# EAGLE design untitled (EAGLE 9.6.2)

## Sheet 1 of 3
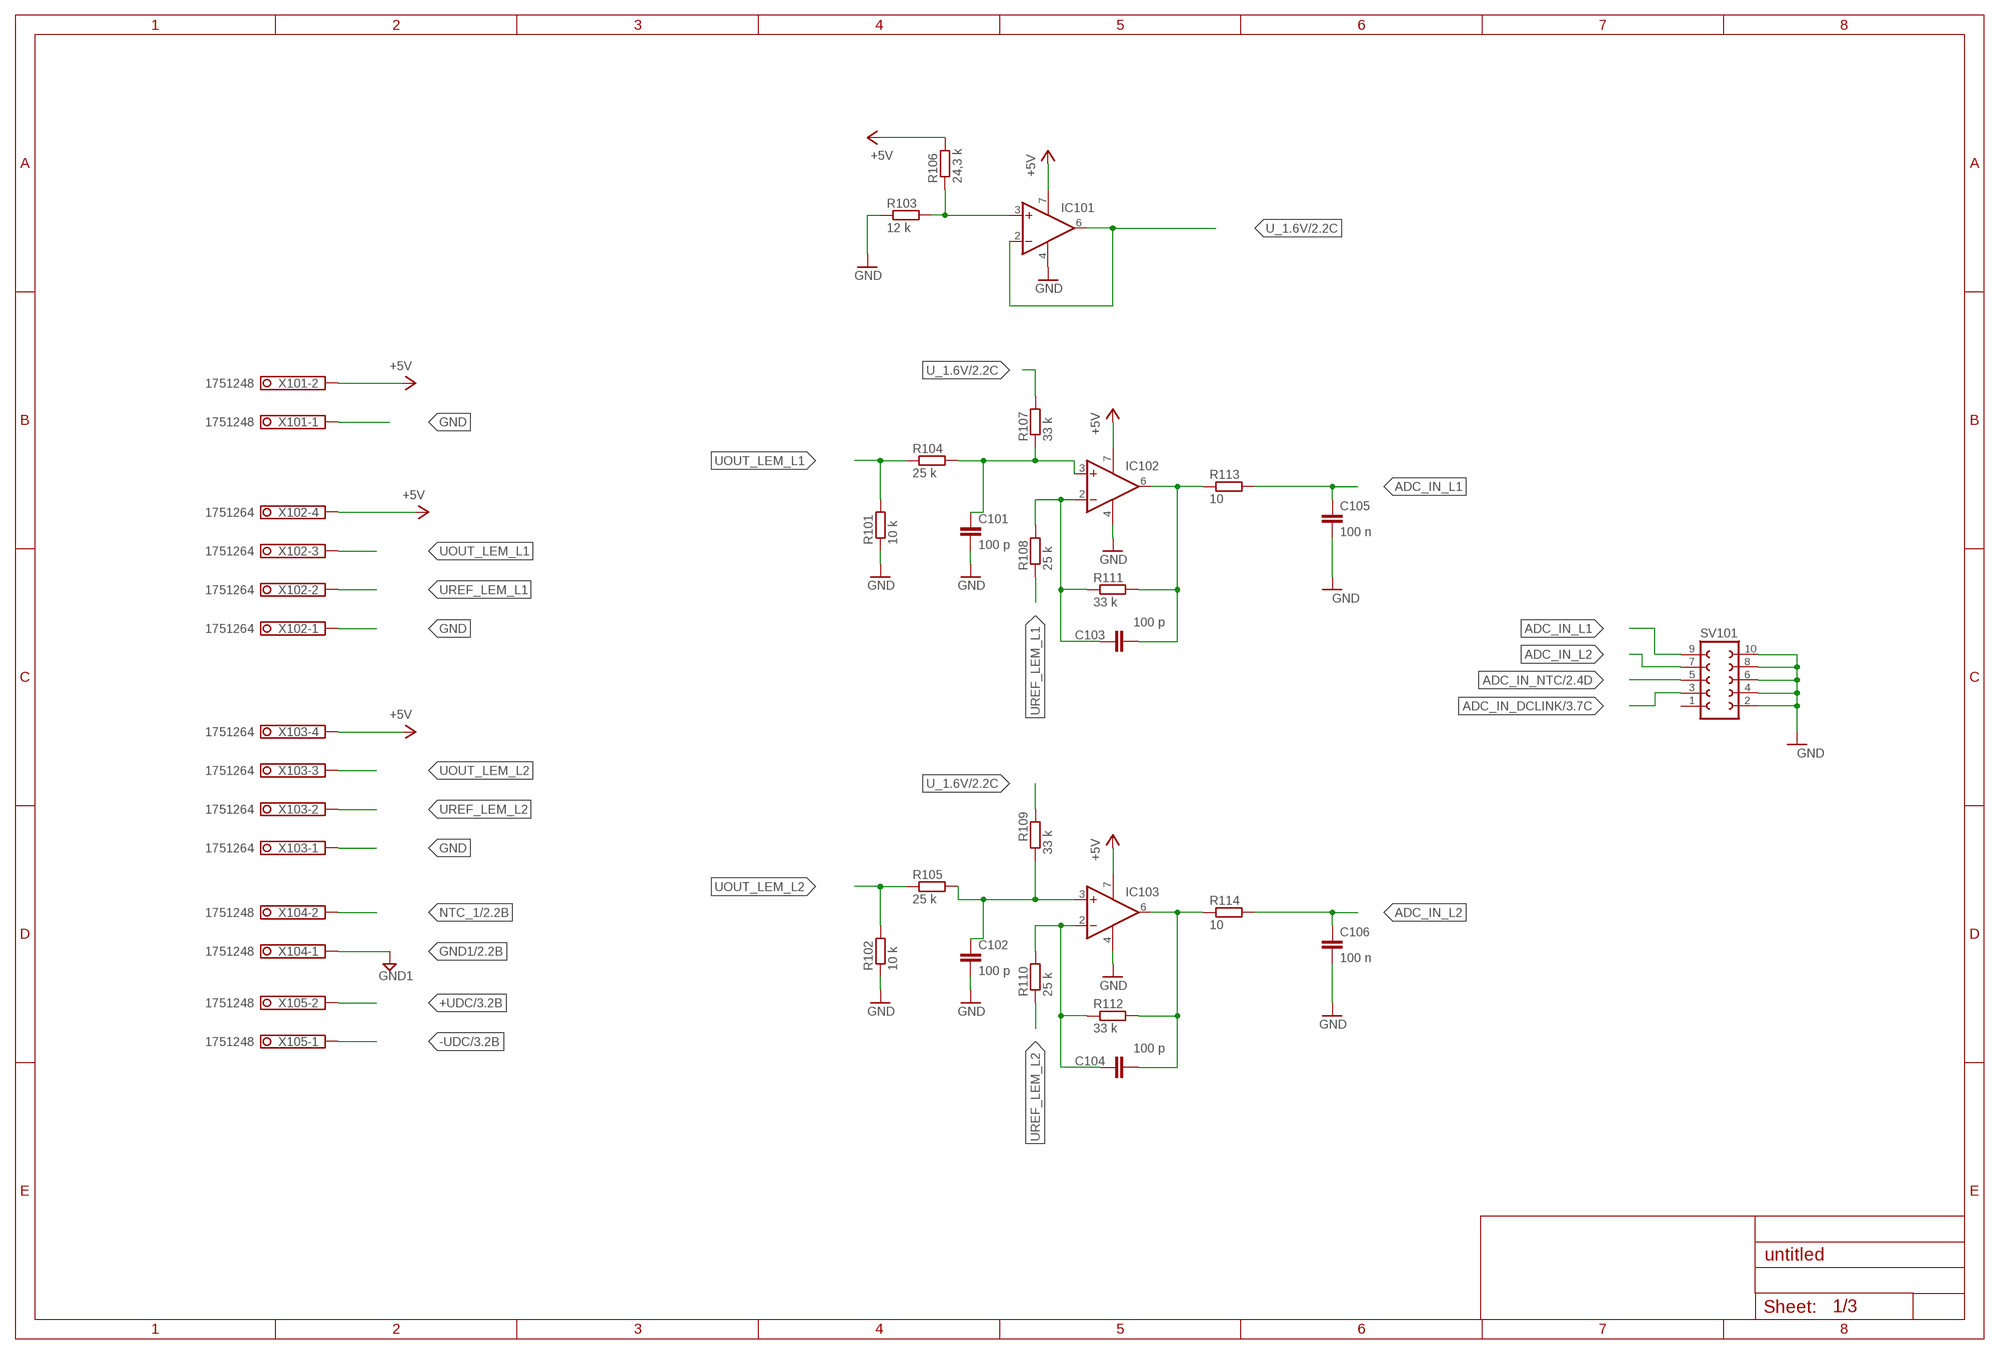
[diagram p0: schematic, sheet 1]

### Parts
C101  100 p  C-EUC0603  [C0603]
C102  100 p  C-EUC0603  [C0603]
C103  100 p  C-EUC0603  [C0603]
C104  100 p  C-EUC0603  [C0603]
C105  100 n  C-EUC1206  [C1206]
C106  100 n  C-EUC1206  [C1206]
IC101  1AMP_P7+4D  [SO08]
IC102  1AMP_P7+4D  [SO08]
IC103  1AMP_P7+4D  [SO08]
R101  10 k  R-EU_R0402  [R0402]
R102  10 k  R-EU_R0402  [R0402]
R103  12 k  R-EU_R0402  [R0402]
R104  25 k  R-EU_R0402  [R0402]
R105  25 k  R-EU_R0402  [R0402]
R106  24,3 k  R-EU_R0402  [R0402]
R107  33 k  R-EU_R0402  [R0402]
R108  25 k  R-EU_R0402  [R0402]
R109  33 k  R-EU_R0402  [R0402]
R110  25 k  R-EU_R0402  [R0402]
R111  33 k  R-EU_R0402  [R0402]
R112  33 k  R-EU_R0402  [R0402]
R113  10  R-EU_R0402  [R0402]
R114  10  R-EU_R0402  [R0402]
SV101  FE05-2  [FE05-2]
X101  1751248  [1751248]
X102  1751264  [1751264]
X103  1751264  [1751264]
X104  1751248  [1751248]
X105  1751248  [1751248]

### Nets
+5V: IC101.7(V+) IC102.7(V+) IC103.7(V+) R106.2 X101.2 X102.4 X103.4 ; also sheet 2,3
+UDC: X105.2 ; also sheet 3
-UDC: X105.1 ; also sheet 3
ADC_IN_DCLINK: SV101.3 ; also sheet 3
ADC_IN_L1: C105.1 R113.2 SV101.9
ADC_IN_L2: C106.1 R114.2 SV101.7
ADC_IN_NTC: SV101.5 ; also sheet 2
GND: C101.2 C102.2 C105.2 C106.2 IC101.4(V-) IC102.4(V-) IC103.4(V-) R101.1 R102.1 R103.1 SV101.2 SV101.4 SV101.6 SV101.8 SV101.10 X101.1 X102.1 X103.1 ; also sheet 2,3
GND1: X104.1 ; also sheet 2
N$1: C104.1 IC103.2(-IN) R110.2 R112.1
N$2: C104.2 IC103.6(OUT) R112.2 R114.1
N$3: C103.1 IC102.2(-IN) R108.2 R111.1
N$5: C103.2 IC102.6(OUT) R111.2 R113.1
N$8: IC101.3(+IN) R103.2 R106.1
N$15: C102.1 IC103.3(+IN) R105.2 R109.1
N$16: C101.1 IC102.3(+IN) R104.2 R107.1
NTC_1: X104.2 ; also sheet 2
U_1.6V: IC101.2(-IN) IC101.6(OUT) R107.2 R109.2 ; also sheet 2,3
UOUT_LEM_L1: R101.2 R104.1 X102.3
UOUT_LEM_L2: R102.2 R105.1 X103.3
UREF_LEM_L1: R108.1 X102.2
UREF_LEM_L2: R110.1 X103.2
Unconnected: SV101.1

## Sheet 2 of 3
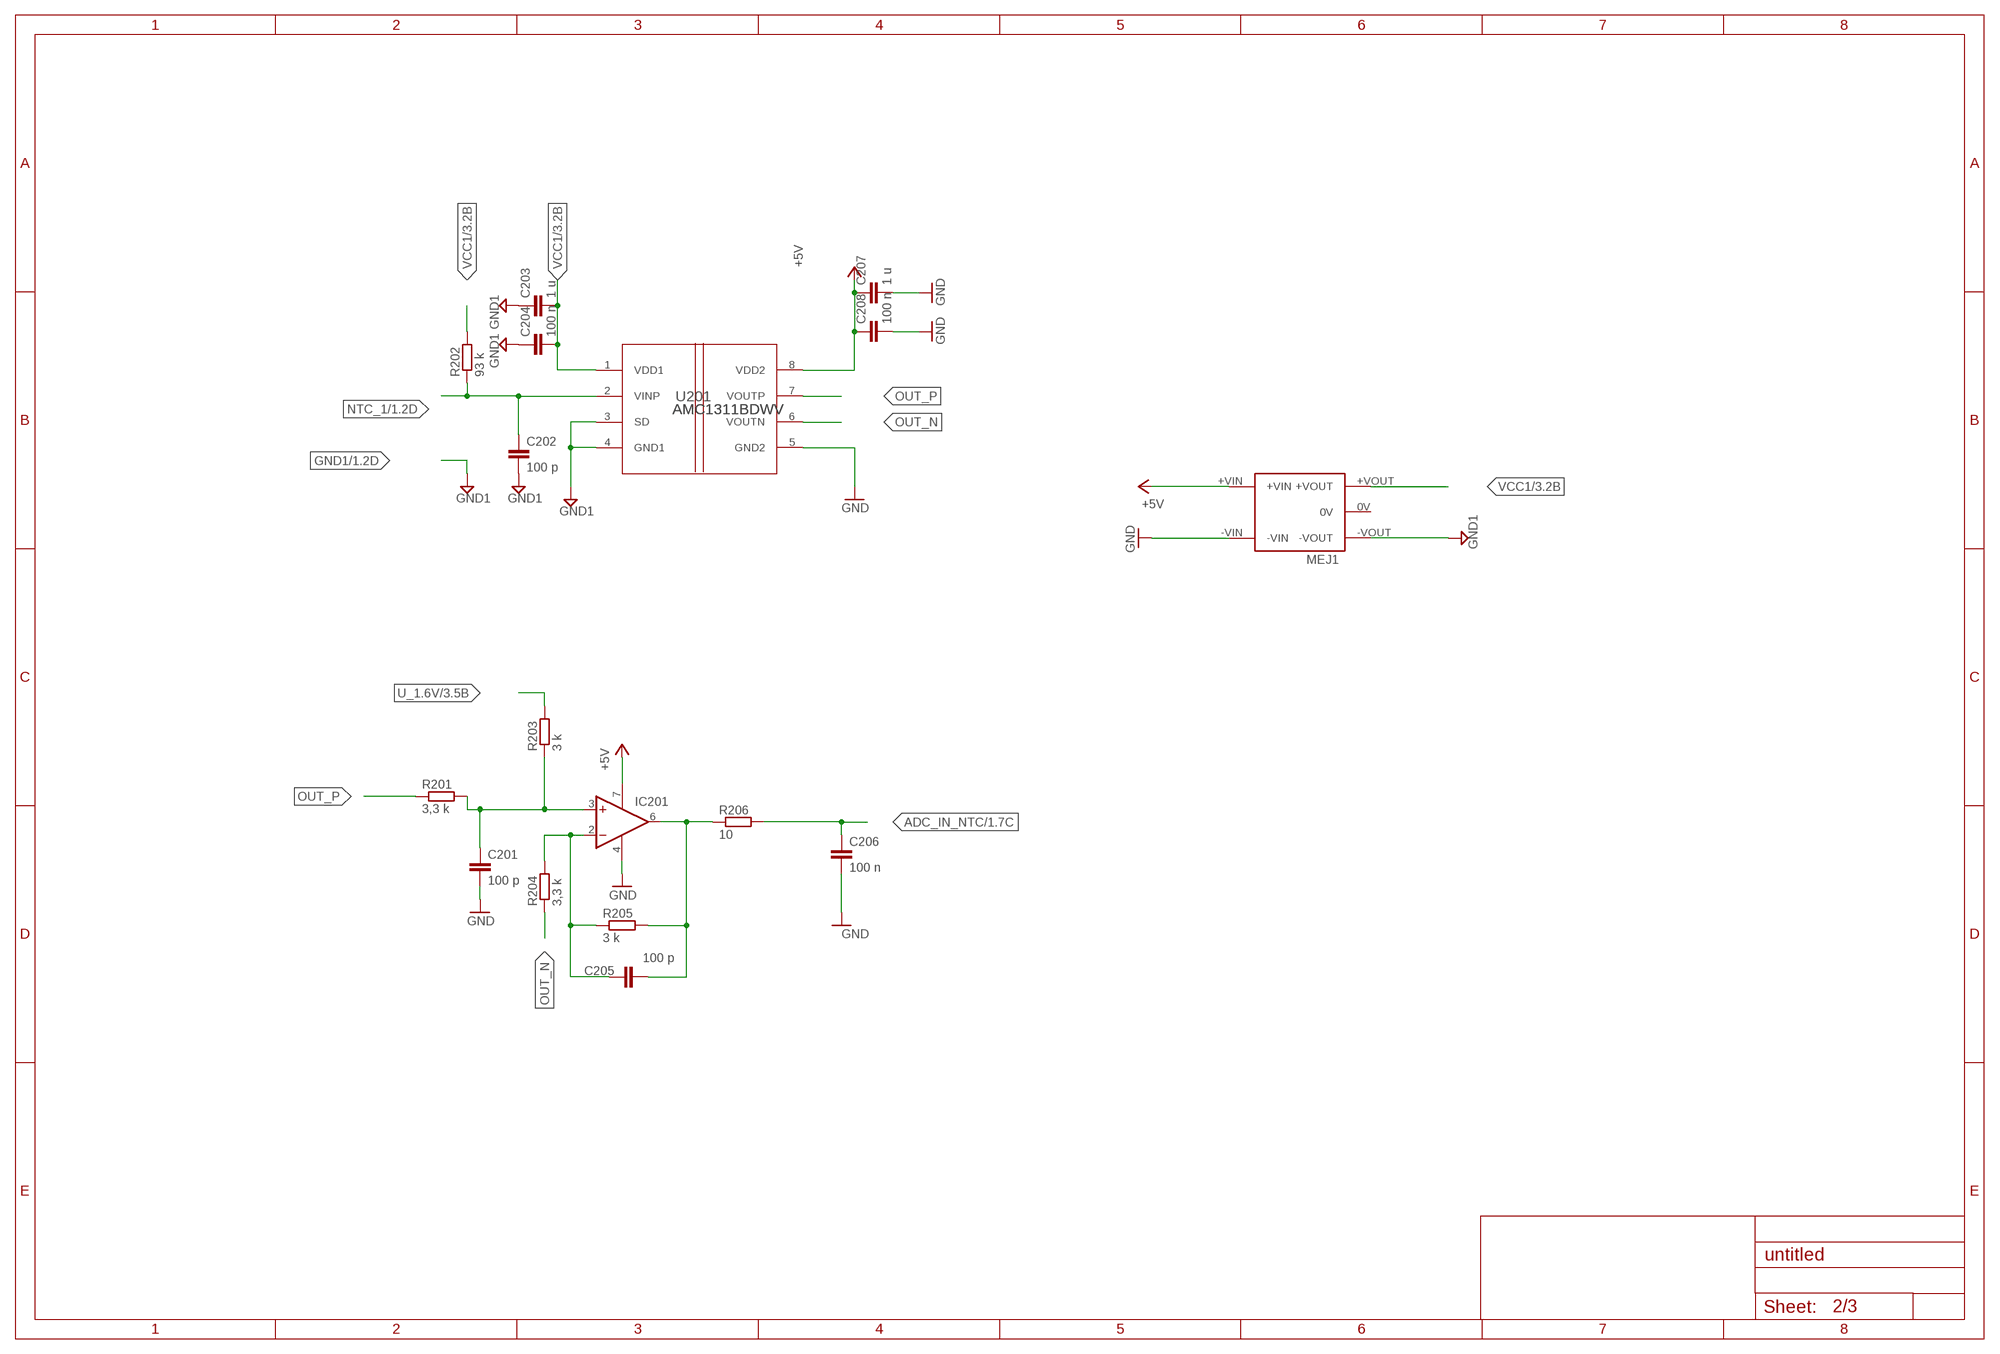
[diagram p1: schematic, sheet 2]

### Parts
C201  100 p  C-EUC0603  [C0603]
C202  100 p  C-EUC0603  [C0603]
C203  1 u  C-EUC0805  [C0805]
C204  100 n  C-EUC0805  [C0805]
C205  100 p  C-EUC0603  [C0603]
C206  100 n  C-EUC1206  [C1206]
C207  1 u  C-EUC0805  [C0805]
C208  100 n  C-EUC0805  [C0805]
IC201  1AMP_P7+4D  [SO08]
MEJ1  MEJ1  [MEJ1]
R201  3,3 k  R-EU_R0402  [R0402]
R202  93 k  R-EU_R0402  [R0402]
R203  3 k  R-EU_R0402  [R0402]
R204  3,3 k  R-EU_R0402  [R0402]
R205  3 k  R-EU_R0402  [R0402]
R206  10  R-EU_R0402  [R0402]
U201  AMC1311BDWV  [DWV0008A]

### Nets
+5V: C207.1 C208.1 IC201.7(V+) MEJ1.+VIN U201.8(VDD2) ; also sheet 1,3
ADC_IN_NTC: C206.1 R206.2 ; also sheet 1
GND: C201.2 C206.2 C207.2 C208.2 IC201.4(V-) MEJ1.-VIN U201.5(GND2) ; also sheet 1,3
GND1: C202.2 C203.1 C204.1 MEJ1.-VOUT U201.3(SD) U201.4(GND1) ; also sheet 1
N$4: C205.1 IC201.2(-IN) R204.2 R205.1
N$7: C205.2 IC201.6(OUT) R205.2 R206.1
N$14: C201.1 IC201.3(+IN) R201.2 R203.1
NTC_1: C202.1 R202.1 U201.2(VINP) ; also sheet 1
OUT_N: R204.1 U201.6(VOUTN)
OUT_P: R201.1 U201.7(VOUTP)
U_1.6V: R203.2 ; also sheet 1,3
VCC1: C203.2 C204.2 MEJ1.+VOUT R202.2 U201.1(VDD1) ; also sheet 3
Unconnected: MEJ1.0V

## Sheet 3 of 3
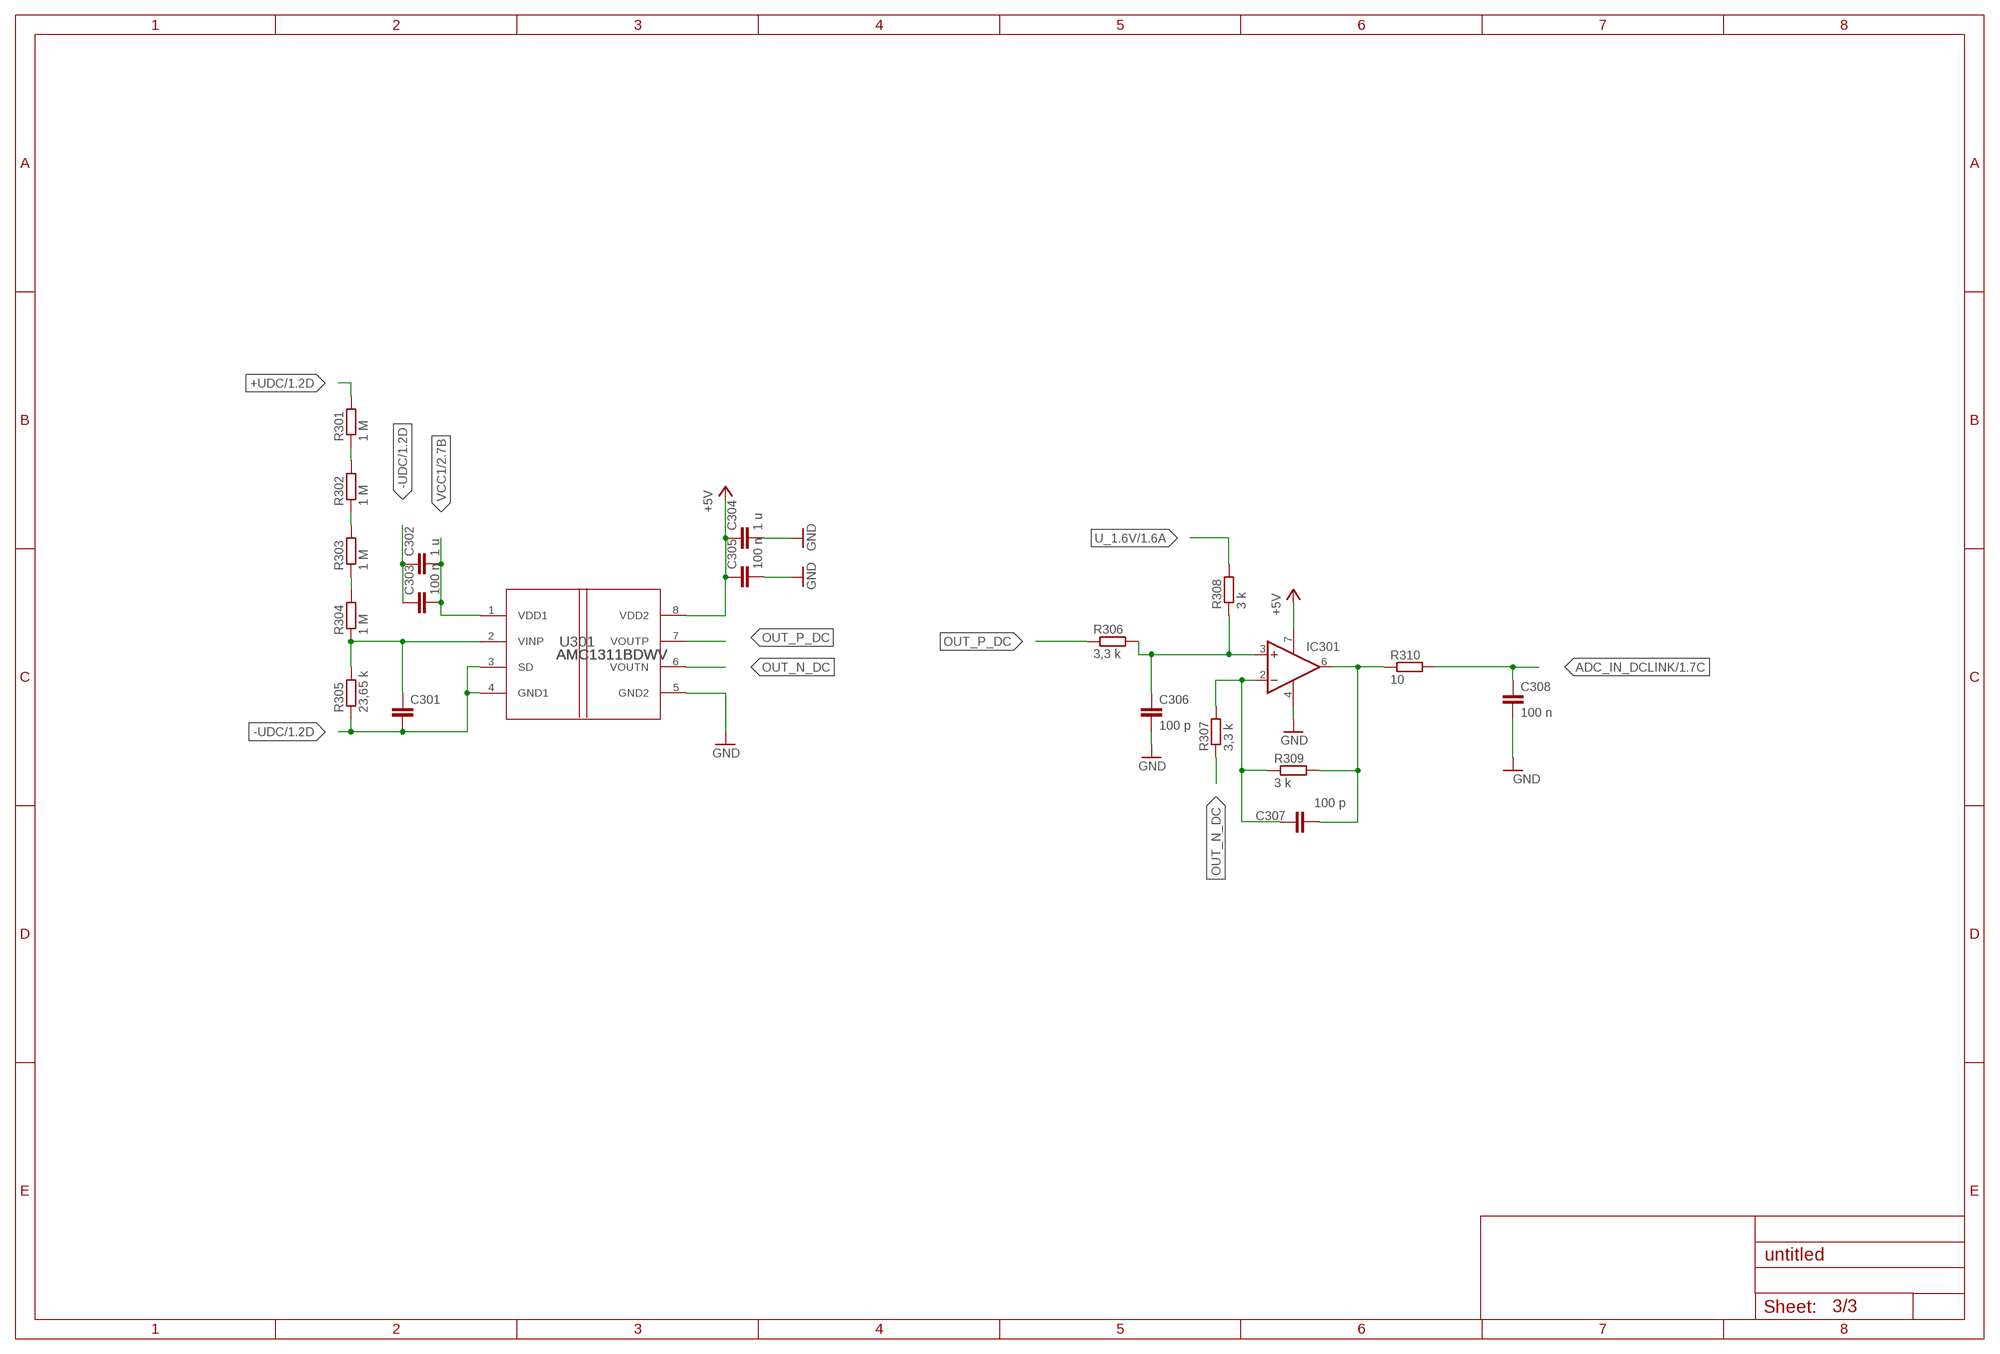
[diagram p2: schematic, sheet 3]

### Parts
C301  100 p  C-EUC0603  [C0603]
C302  1 u  C-EUC0805  [C0805]
C303  100 n  C-EUC0805  [C0805]
C304  1 u  C-EUC0805  [C0805]
C305  100 n  C-EUC0805  [C0805]
C306  100 p  C-EUC0603  [C0603]
C307  100 p  C-EUC0603  [C0603]
C308  100 n  C-EUC1206  [C1206]
IC301  1AMP_P7+4D  [SO08]
R301  1 M  R-EU_R0603  [R0603]
R302  1 M  R-EU_R0603  [R0603]
R303  1 M  R-EU_R0603  [R0603]
R304  1 M  R-EU_R0603  [R0603]
R305  23,65 k  R-EU_R0603  [R0603]
R306  3,3 k  R-EU_R0402  [R0402]
R307  3,3 k  R-EU_R0402  [R0402]
R308  3 k  R-EU_R0402  [R0402]
R309  3 k  R-EU_R0402  [R0402]
R310  10  R-EU_R0402  [R0402]
U301  AMC1311BDWV  [DWV0008A]

### Nets
+5V: C304.1 C305.1 IC301.7(V+) U301.8(VDD2) ; also sheet 1,2
+UDC: R301.2 ; also sheet 1
-UDC: C301.2 C302.1 C303.1 R305.1 U301.3(SD) U301.4(GND1) ; also sheet 1
ADC_IN_DCLINK: C308.1 R310.2 ; also sheet 1
GND: C304.2 C305.2 C306.2 C308.2 IC301.4(V-) U301.5(GND2) ; also sheet 1,2
N$6: R303.1 R304.2
N$9: R301.1 R302.2
N$10: C307.1 IC301.2(-IN) R307.2 R309.1
N$11: C307.2 IC301.6(OUT) R309.2 R310.1
N$12: R302.1 R303.2
N$13: C306.1 IC301.3(+IN) R306.2 R308.1
N$17: C301.1 R304.1 R305.2 U301.2(VINP)
OUT_N_DC: R307.1 U301.6(VOUTN)
OUT_P_DC: R306.1 U301.7(VOUTP)
U_1.6V: R308.2 ; also sheet 1,2
VCC1: C302.2 C303.2 U301.1(VDD1) ; also sheet 2

## Library data of the parts
C101-C106 C201-C208 C301-C308 = rcl:C-EU: CAPACITOR, European symbol; SPICEPREFIX: C
IC101-IC103 IC201 IC301 = linear:1AMP_P7+4: OP AMP
MEJ1 = untitled:MEJ1
R101-R114 R201-R206 R301-R310 = rcl:R-EU_: RESISTOR, European symbol; SPICEPREFIX: R
SV101 = con-lsta:FE05-2: FEMALE HEADER; OC_FARNELL: unknown; OC_NEWARK: unknown
U201 U301 = untitled1:AMC1311BDWV; COPYRIGHT: Copyright (C) 2024 Ultra Librarian. All rights reserved.; MANUFACTURER_PART_NUMBER: AMC1311BDWV; MFR_NAME: Texas Instruments; REFDES: RefDes; TYPE: TYPE
X101 X104 X105 = con-phoenix-350:1751248: MKDS 1/ 2-3,5 Printklemme Nennstrom: 10 A Bemessungsspannung: 160 V Raster: 3,5 mm Polzahl: 2 Montageart: Löten Anschlussart: Schraubanschluss Anschlussrichtung vom Leiter zur Platine: 0° Source: http://eshop.phoenixcontact.com .. 1751248.pdf; OC_FARNELL: unknown; OC_NEWARK: unknown
X102 X103 = con-phoenix-350:1751264: MKDS 1/ 4-3,5 Printklemme Nennstrom: 10 A Bemessungsspannung: 160 V Raster: 3,5 mm Polzahl: 4 Montageart: Löten Anschlussart: Schraubanschluss Anschlussrichtung vom Leiter zur Platine: 0° Source: http://eshop.phoenixcontact.com .. 1751264.pdf; MPN: 1751264; OC_FARNELL: unknown; OC_NEWARK: 10R0934

## Board
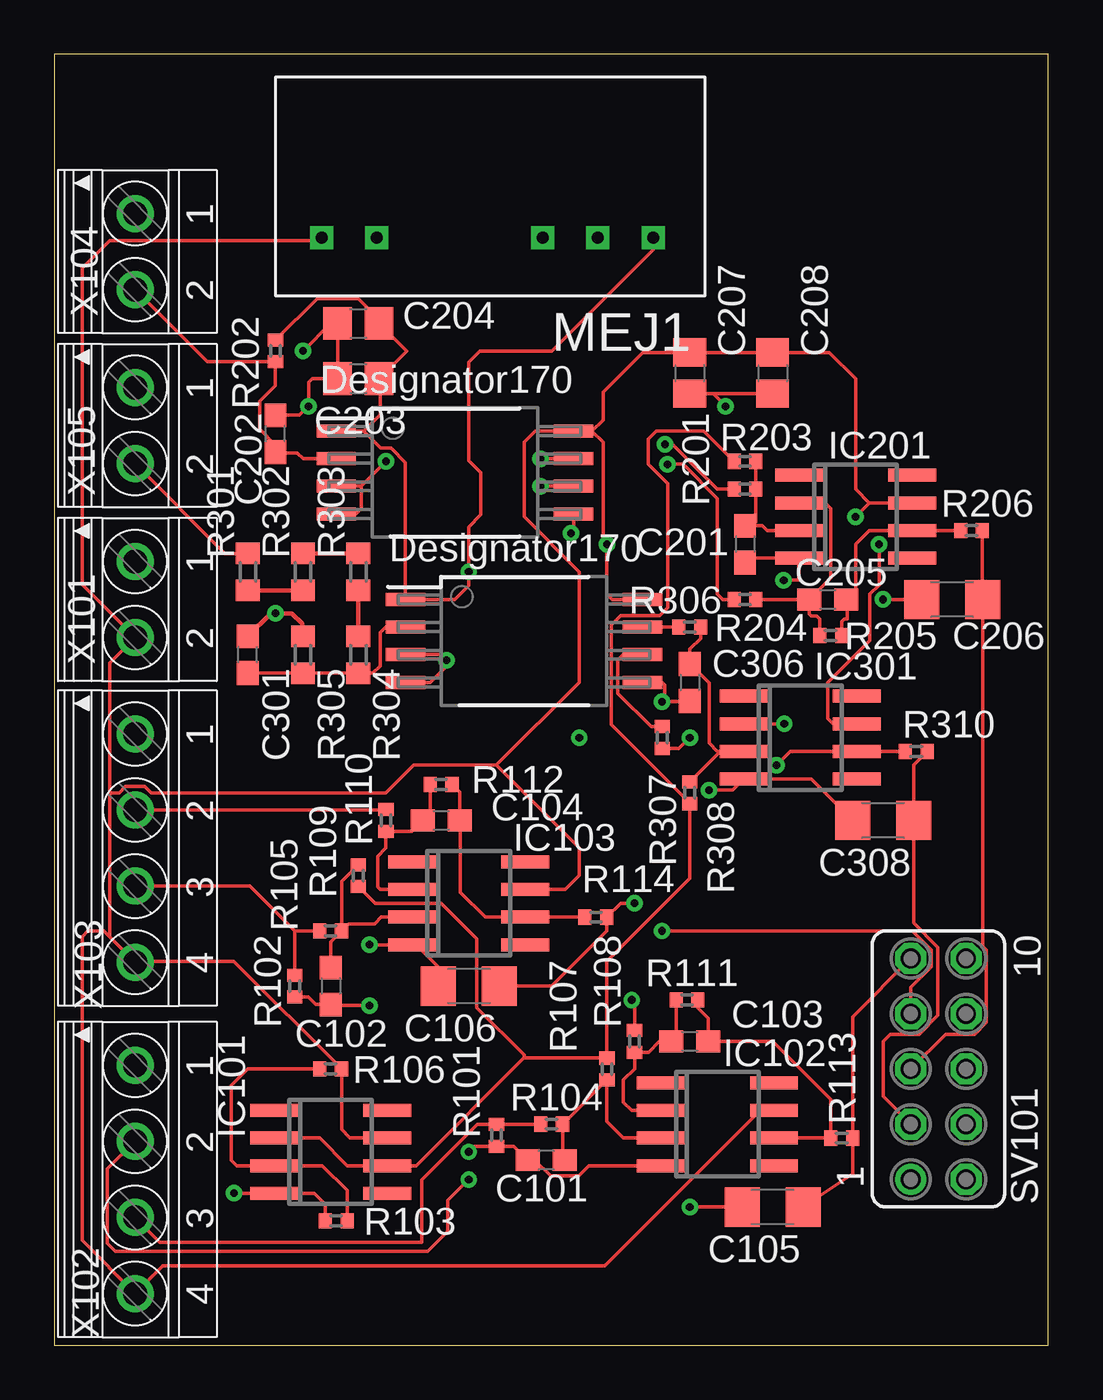
[diagram p3: board, top side]
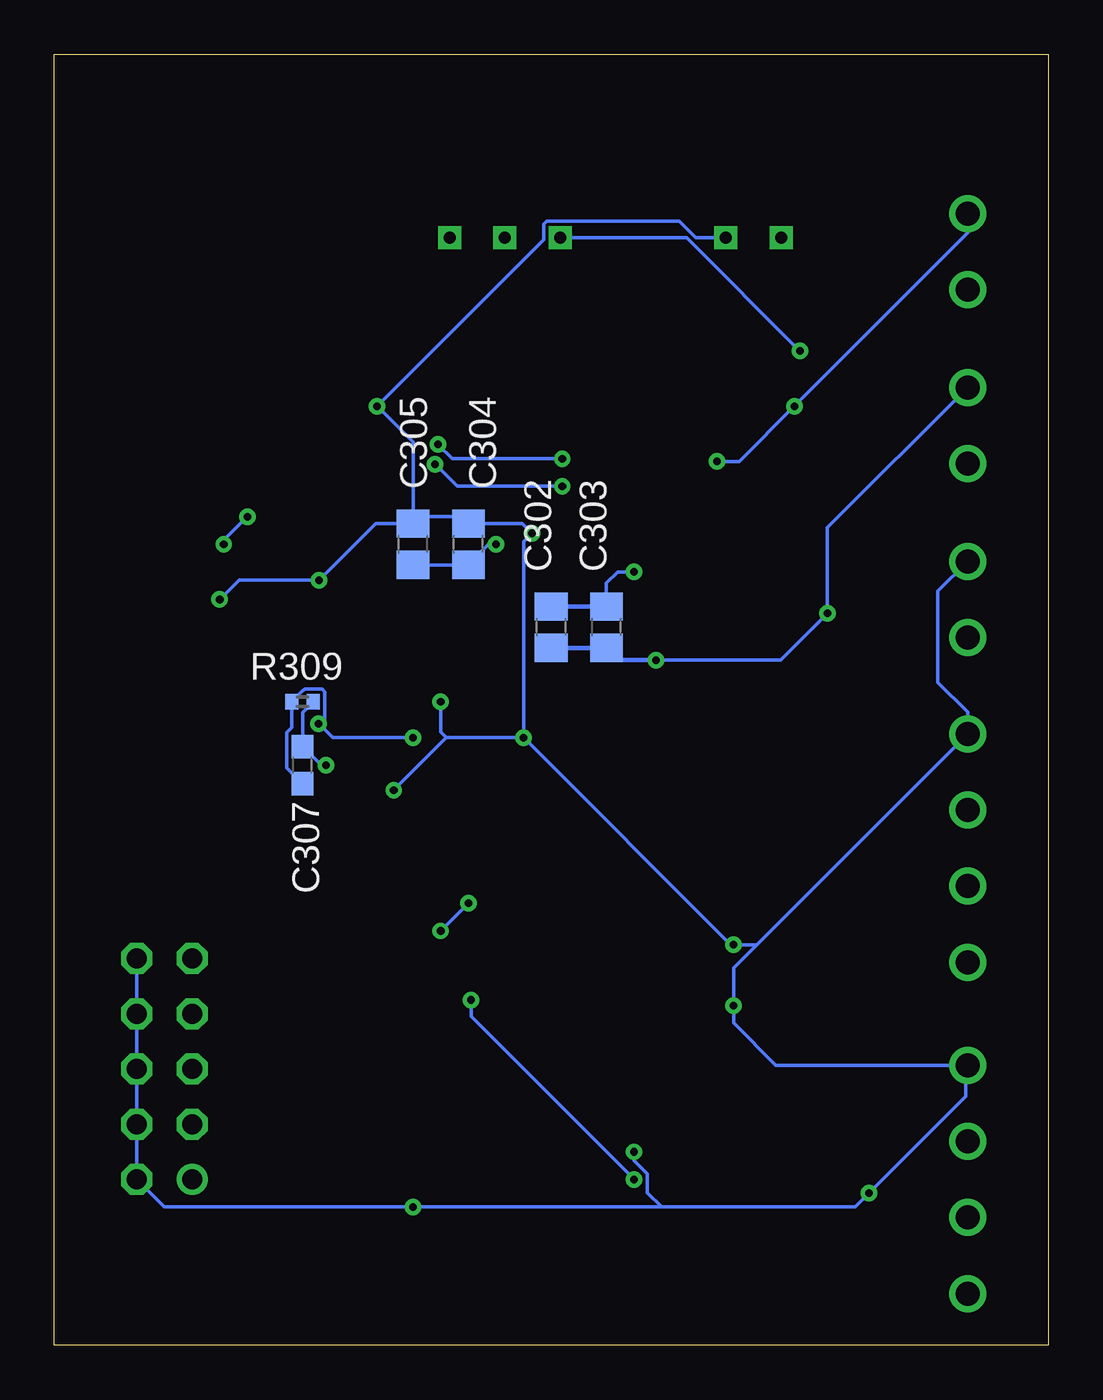
[diagram p4: board, bottom side, seen from below]

Size 45.7 x 59.36 mm. Coordinates in mm from the lower left corner, seen from the top.
Outline: 0,0 45.7,0 45.7,59.36 0,59.36 0,0
Copper layers (1*16): Top 0.035mm / dielectric 1.5mm / Bottom 0.035mm
Design rules "default": minimum track width 6mil, minimum drill 0.35mm, track to track 6mil, track to pad 6mil, pad to pad 6mil, via to via 6mil, smd to smd 6mil, copper to edge 40mil, drill to drill 6mil, minimum pad ring 10mil, minimum via ring 8mil, stop-mask expansion 4mil, vias tented up to drill 0mil, thermal gap 10mil

### Footprints (pad centres in the part's own frame; a part is rotated, then mirrored left to right if it is on the bottom)
C0603 = smd 1.1 x 1: 1 -0.85,0; 2 0.85,0
C1206 = smd 1.6 x 1.8: 1 -1.4,0; 2 1.4,0
C0805 = smd 1.3 x 1.5: 1 -0.95,0; 2 0.95,0
SO08 = smd 0.6 x 2.2: 1 -1.905,-2.6; 2 -0.635,-2.6; 3 0.635,-2.6; 4 1.905,-2.6; 5 1.905,2.6; 6 0.635,2.6; 7 -0.635,2.6; 8 -1.905,2.6
MEJ1 = drill 0.55 square: 0V 14.83,2.67; +VIN 2.13,2.67; +VOUT 17.37,2.67; -VIN 4.67,2.67; -VOUT 12.29,2.67
R0402 = smd 0.6 x 0.7: 1 -0.5,0; 2 0.5,0
R0603 = smd 1 x 1.1: 1 -0.85,0; 2 0.85,0
FE05-2 = drill 0.914: 1 -5.08,1.27 | drill 0.914 octagon: 2 -5.08,-1.27; 3 -2.54,1.27; 4 -2.54,-1.27; 5 0,1.27; 6 0,-1.27; 7 2.54,1.27; 8 2.54,-1.27; 9 5.08,1.27; 10 5.08,-1.27
DWV0008A = smd 1.8 x 0.6: 1 -5.45,1.905; 2 -5.45,0.635; 3 -5.45,-0.635; 4 -5.45,-1.905; 5 5.45,-1.905; 6 5.45,-0.635; 7 5.45,0.635; 8 5.45,1.905
1751248 = drill 1.1 pad 1.7: 1 -1.75,-0.1; 2 1.75,-0.1
1751264 = drill 1.1 pad 1.7: 1 -5.25,-0.1; 2 -1.75,-0.1; 3 1.75,-0.1; 4 5.25,-0.1

### Placement (x,y rotation side)
C101  22.61,8.51 180 top
C102  12.7,16.51 270 top
C103  29.21,13.97 0 top
C104  17.78,24.13 0 top
C105  33.02,6.35 180 top
C106  19.05,16.51 180 top
C201  31.75,36.83 270 top
C202  10.16,41.91 90 top
C203  13.97,44.45 0 top
C204  13.97,46.99 0 top
C205  35.56,34.29 0 top
C206  41.27,34.29 180 top
C207  29.21,44.7 270 top
C208  33.02,44.7 270 top
C301  8.89,31.75 90 top
C302  22.86,33.02 90 bottom
C303  20.32,33.02 90 bottom
C304  26.67,36.83 90 bottom
C305  29.21,36.83 90 bottom
C306  29.21,30.48 270 top
C307  34.29,26.67 90 bottom
C308  38.1,24.13 180 top
IC101  12.7,8.89 270 top
IC102  30.48,10.16 270 top
IC103  19.05,20.32 270 top
IC201  36.83,38.1 270 top
IC301  34.29,27.94 270 top
MEJ1  10.16,48.26 0 top
R101  20.32,9.65 90 top
R102  11.05,16.51 90 top
R103  12.95,5.71 0 top
R104  22.86,10.16 0 top
R105  12.7,19.05 0 top
R106  12.7,12.7 0 top
R107  25.4,12.7 90 top
R108  26.67,13.97 270 top
R109  13.97,21.59 270 top
R110  15.24,24.13 270 top
R111  29.08,15.88 0 top
R112  17.78,25.78 0 top
R113  36.2,9.53 0 top
R114  24.89,19.68 0 top
R201  31.75,39.37 0 top
R202  10.16,45.72 90 top
R203  31.75,40.64 180 top
R204  31.75,34.29 0 top
R205  35.69,32.64 0 top
R206  42.16,37.47 0 top
R301  8.89,35.56 90 top
R302  11.43,35.56 270 top
R303  13.97,35.56 90 top
R304  13.97,31.75 90 top
R305  11.43,31.75 270 top
R306  29.21,33.02 0 top
R307  27.94,27.94 270 top
R308  29.21,25.4 270 top
R309  34.29,29.59 0 bottom
R310  39.62,27.3 0 top
SV101  40.64,12.7 90 top
U201  18.41,40.13 0 top
U301  21.59,32.38 0 top
X101  3.81,34.29 270 top
X102  3.81,7.62 270 top
X103  3.81,22.86 270 top
X104  3.81,50.29 270 top
X105  3.81,42.29 270 top

### Tracks (layer width: path | path; a pad name or v marks a point on that pad's centre or on a via)
+5V  (via drill 0.35)
  Top 0.152: X103.4 3.67,17.64 | 3.67,17.64 2.54,18.78 | 2.54,18.78 2.54,25.4 | 2.54,25.4 2.98,25.4 3.26,25.69 4.16,25.69 4.45,25.4 15.24,25.4 16.51,26.67 20.32,26.67 | 20.32,26.67 24.13,22.86 24.13,21.59 23.5,20.95 IC103.7 | 3.67,17.64 8.26,17.64 R106.2 13.2,9.91 13.59,9.53 IC101.7 | IC102.7 32.45,10.79 25.3,3.64 4.98,3.64 X102.4 1.27,4.81 1.27,18.78 1.54,19.05 2.27,19.05 2.54,18.78 | 2.54,25.4 2.54,31.37 X101.2 1.27,34.98 1.27,49.53 2.54,50.8 12.16,50.8 MEJ1.+VIN | 37.47,38.73 36.83,39.37 36.83,44.45 35.63,45.65 C208.1 C207.1 27.04,45.65 25.22,43.84 25.22,42.55 24.71,42.04 | 37.47,38.73 IC201.7 | 20.32,26.67 24.13,30.48 24.13,35.56 21.59,38.1 21.59,41.53 22.1,42.04 U201.8 24.71,42.04 | 37.47,38.73 v36.83,38.1 | v37.91,36.83 37.91,34.96 37.49,34.54 37.49,32.41 35.56,30.48 35.56,28.83 35.81,28.57 IC301.7 | 24.71,42.04 25.22,41.53 25.22,37.01 v25.4,36.83 25.4,34.54 25.65,34.29 U301.8
  Bottom 0.152: C305.1 C304.1 25.72,36.83 v25.4,36.83 | v36.83,38.1 37.91,37.02 v37.91,36.83
+UDC
  Top 0.152: R301.2 7.84,36.41 X105.2
-UDC  (via drill 0.35)
  Top 0.152: U301.4 17.27,30.48 18.03,31.24 v18.03,31.5 17.78,31.75 U301.3
  Top 0.203: R305.1 11.39,32.64 11.39,33.19 10.92,33.66 v10.16,33.66 9.95,33.66 C301.2
  Bottom 0.152: v18.03,31.5 12.32,31.5 v10.16,33.66 10.16,37.59 X105.1
  Bottom 0.203: C302.1 C303.1 19.75,31.5 v18.03,31.5
ADC_IN_DCLINK
  Top 0.152: R310.2 39.5,26.68 C308.1 39.5,19.41 40.62,18.3 40.62,15.16 39.76,14.3 38.43,14.3 38.1,13.97 38.1,11.43 SV101.3
ADC_IN_L1
  Top 0.152: C105.1 36.7,7.88 R113.2 36.7,15.11 SV101.9
ADC_IN_L2  (via drill 0.35)
  Top 0.152: C106.1 22.86,16.51 25.4,19.05 R114.2 26.03,20.32 v26.67,20.32 | SV101.7 39.37,16.45 40.31,17.39 40.31,18.17 39.43,19.05 v27.94,19.05
  Bottom 0.152: v26.67,20.32 v27.94,19.05
ADC_IN_NTC
  Top 0.152: R206.2 42.66,34.3 C206.1 42.67,18.34 42.85,18.17 42.85,14.85 42.3,14.3 40.97,14.3 SV101.5
GND  (via drill 0.35)
  Top 0.152: R103.1 12.45,6.47 11.94,6.99 IC101.4 v8.26,6.99 | v14.48,18.41 IC103.4 16.64,18.41 17.65,17.4 C106.2 | v14.48,15.62 12.74,15.62 C102.2 12.03,15.66 11.68,16.01 R102.1 | v19.05,8.89 19.31,9.15 R101.1 21.11,9.15 C101.2 22.08,8.51 22.81,7.78 24.1,7.78 24.57,8.26 IC102.4 | v29.21,6.35 C105.2 | C208.2 C207.2 30.29,43.75 v30.86,43.18 | C201.2 31.96,36.2 IC201.4 34.23,35.18 v33.53,35.18 | v38.1,34.29 C206.2 | C308.2 34.8,26.04 IC301.4 31.18,25.53 v30.1,25.53 | C306.2 29.17,29.59 v27.94,29.59 28.07,29.72 28.07,30.35 27.94,30.48 U301.5 | v23.75,37.34 23.86,37.45 U201.5
  Bottom 0.152: X102.1 3.81,12.87 | 3.81,12.87 12.53,12.87 14.48,14.82 v14.48,15.62 14.48,17.34 13.4,18.41 | 13.4,18.41 X103.1 3.71,29.11 5.08,30.48 5.08,34.67 X101.1 | 13.4,18.41 v14.48,18.41 14.61,18.41 v24.13,27.94 | 17.78,6.35 8.89,6.35 v8.26,6.99 3.81,11.43 3.81,12.87 | 17.78,6.35 v29.21,6.35 40.64,6.35 SV101.2 SV101.4 SV101.6 SV101.8 SV101.10 | v38.1,34.29 37.21,35.18 v33.53,35.18 30.93,37.78 C305.2 | C305.2 28.89,38.1 26.67,38.1 C304.2 24.19,37.78 v23.75,37.34 24.13,36.96 v24.13,27.94 | v30.1,25.53 27.69,27.94 | 27.69,27.94 v24.13,27.94 | v19.05,8.89 19.05,8.48 18.44,7.87 18.44,7.01 17.78,6.35 | C305.2 29.21,41.53 v30.86,43.18 23.21,50.83 23.21,51.55 23.07,51.69 16.97,51.69 16.21,50.93 MEJ1.-VIN | 27.69,27.94 27.94,28.19 v27.94,29.59
GND1  (via drill 0.35)
  Top 0.152: v11.43,45.72 12.7,46.99 C204.1 C203.1 11.85,44.45 11.68,44.28 v11.68,43.18 11.26,42.76 C202.2 | v15.24,40.64 14.1,39.5 | 14.1,39.5 U201.3 | 14.1,39.5 14.1,38.48 13.84,38.23 U201.4
  Bottom 0.152: v15.24,40.64 14.22,40.64 v11.68,43.18 3.71,51.15 X104.1 | v11.43,45.72 16.64,50.93 MEJ1.-VOUT
N$1
  Top 0.152: IC103.2 14.99,20.95 14.86,21.08 14.86,22.48 15.24,22.86 R110.2 16.43,23.63 C104.1 17.28,24.48 R112.1
N$2
  Top 0.152: R112.2 18.63,25.43 C104.2 18.67,24.09 18.67,20.83 19.81,19.68 IC103.6 R114.1
N$3
  Top 0.152: R111.1 28.58,14.19 C103.1 27.81,13.97 27.31,13.47 R108.2 26.67,12.7 26.16,12.19 26.16,11.18 26.54,10.79 IC102.2
N$4
  Top 0.152: R204.2 C205.1 | R205.1 35.19,33.39 35.05,33.53 34.8,33.53 34.71,33.62 C205.1 | C205.1 35.69,35.27 35.69,38.48 35.43,38.73 IC201.2
N$5
  Top 0.152: IC102.6 35.69,9.53 | 35.69,9.53 R113.1 | R111.2 29.58,15.5 30.06,15.03 C103.2 33.02,13.97 35.69,11.3 35.69,9.53
N$6
  Top 0.203: R303.1 R304.2
N$7
  Top 0.152: R205.2 36.2,33.27 36.32,33.4 36.45,33.4 36.45,34.25 C205.2 36.83,34.71 36.83,36.83 37.47,37.47 IC201.6 R206.1
N$8
  Top 0.152: R106.1 8.89,12.7 8.13,11.94 8.13,8.51 8.38,8.26 IC101.3 12.32,8.26 13.45,7.12 R103.2
N$9
  Top 0.203: R301.1 R302.2
N$10  (via drill 0.35)
  Top 0.152: v33.55,28.58 v33.55,28.57 IC301.2 | R307.2 28.71,27.44 v29.21,27.94
  Bottom 0.152: C307.1 35.02,26.55 35.02,28.16 34.79,28.39 R309.1 34.29,30.1 34.26,30.1 34.19,30.17 33.4,30.17 33.26,30.04 33.26,29.66 33.26,29.21 33.26,28.77 33.44,28.58 v33.55,28.58 32.91,27.94 v29.21,27.94
N$11  (via drill 0.35)
  Top 0.152: v33.2,26.67 33.84,27.3 IC301.6 R310.1
  Bottom 0.152: R309.2 34.29,29.09 C307.2 33.44,26.67 v33.2,26.67
N$12
  Top 0.203: R302.1 R303.2
N$13
  Top 0.152: R306.2 29.71,32.5 29.21,32 C306.1 30.1,30.44 30.1,27.69 30.48,27.3 30.61,27.3 | 30.61,27.3 IC301.3 | R308.1 30.61,27.3
N$14
  Top 0.152: R203.1 R201.2 32.25,37.85 32.08,37.68 C201.1 32.55,37.68 32.77,37.47 IC201.3
N$15
  Top 0.152: C102.1 12.7,18.55 R105.2 | R105.2 13.2,21.32 R109.1 | R105.2 13.53,19.38 14.73,19.38 15.04,19.68 IC103.3
N$16
  Top 0.152: C101.1 23.36,8.61 R104.2 R107.1 25.4,10.29 26.16,9.53 IC102.3
N$17
  Top 0.152: C301.1 R305.2 R304.1 14.64,30.9 14.99,31.24 14.99,32.77 15.24,33.02 U301.2
NTC_1
  Top 0.152: X104.2 7.03,45.22 R202.1 10.16,44.13 9.43,43.41 9.43,42.12 10.16,41.39 C202.1 10.16,41.02 11.18,41.02 11.43,40.77 U201.2
OUT_N  (via drill 0.35)
  Top 0.152: R204.1 30.73,34.29 30.48,34.54 30.48,38.94 28.91,40.51 v28.19,40.51 | U201.6 v22.35,39.5
  Bottom 0.152: v28.19,40.51 27.18,39.5 v22.35,39.5
OUT_N_DC
  Top 0.152: R307.1 27.44,28.44 25.91,29.97 25.91,31.5 26.16,31.75 U301.6
OUT_P  (via drill 0.35)
  Top 0.152: R201.1 30.48,39.37 28.43,41.42 v28.07,41.42 | U201.7 v22.35,40.77
  Bottom 0.152: v22.35,40.77 27.41,40.77 v28.07,41.42
OUT_P_DC
  Top 0.152: U301.7 R306.1
U_1.6V
  Top 0.152: IC101.2 12.19,9.53 13.46,8.26 IC101.6 16.64,8.26 21.58,13.2 21.59,13.2 | 21.59,13.2 R107.2 25.4,17.65 29.21,21.46 R308.2 29.21,24.93 25.6,28.53 25.6,33.11 26.05,33.55 27.82,33.55 28.19,33.92 28.19,39.62 27.3,40.51 27.3,41.66 27.68,42.03 29.86,42.03 R203.2 | R109.2 14.74,20.32 17.78,20.32 19.42,18.68 19.42,15.52 21.59,13.35 21.59,13.2
UOUT_LEM_L1
  Top 0.152: R104.1 R101.2 19.43,10.15 16.89,7.61 16.89,4.73 4.85,4.73 X102.3
UOUT_LEM_L2
  Top 0.152: R102.2 11.05,19.05 | 11.05,19.05 R105.1 | X103.3 8.99,21.11 11.05,19.05
UREF_LEM_L1  (via drill 0.35)
  Top 0.152: X102.2 2.44,8.1 2.44,4.67 2.79,4.32 17.17,4.32 18.09,5.24 18.09,6.66 v19.05,7.62 | v26.54,15.88 26.67,15.75 R108.1
  Bottom 0.152: v19.05,7.62 26.54,15.11 v26.54,15.88
UREF_LEM_L2
  Top 0.152: X103.2 15.22,24.61 R110.1
VCC1  (via drill 0.35)
  Top 0.152: 15.21,46.7 16.19,45.72 C203.2 14.99,44.38 14.99,42.8 14.22,42.04 | 15.21,46.7 C204.2 | R202.2 12.07,48.13 13.97,48.13 15.21,46.9 15.21,46.7 | U201.1 14.22,42.04 | 14.22,42.04 15.01,41.25 15.49,41.25 16.14,40.6 U301.1 18.41,34.29 19.05,34.92 v19.05,35.56 19.05,37.63 19.61,38.19 19.61,40.13 19.05,40.69 19.05,45.21 19.56,45.72 22.86,45.72 27.53,50.39 MEJ1.+VOUT
  Bottom 0.152: C303.2 20.32,35.05 19.81,35.56 v19.05,35.56
  Bottom 0.203: C302.2 C303.2